# EAGLE design village_control (EAGLE 9.6.2)

## Sheet 1 of 3
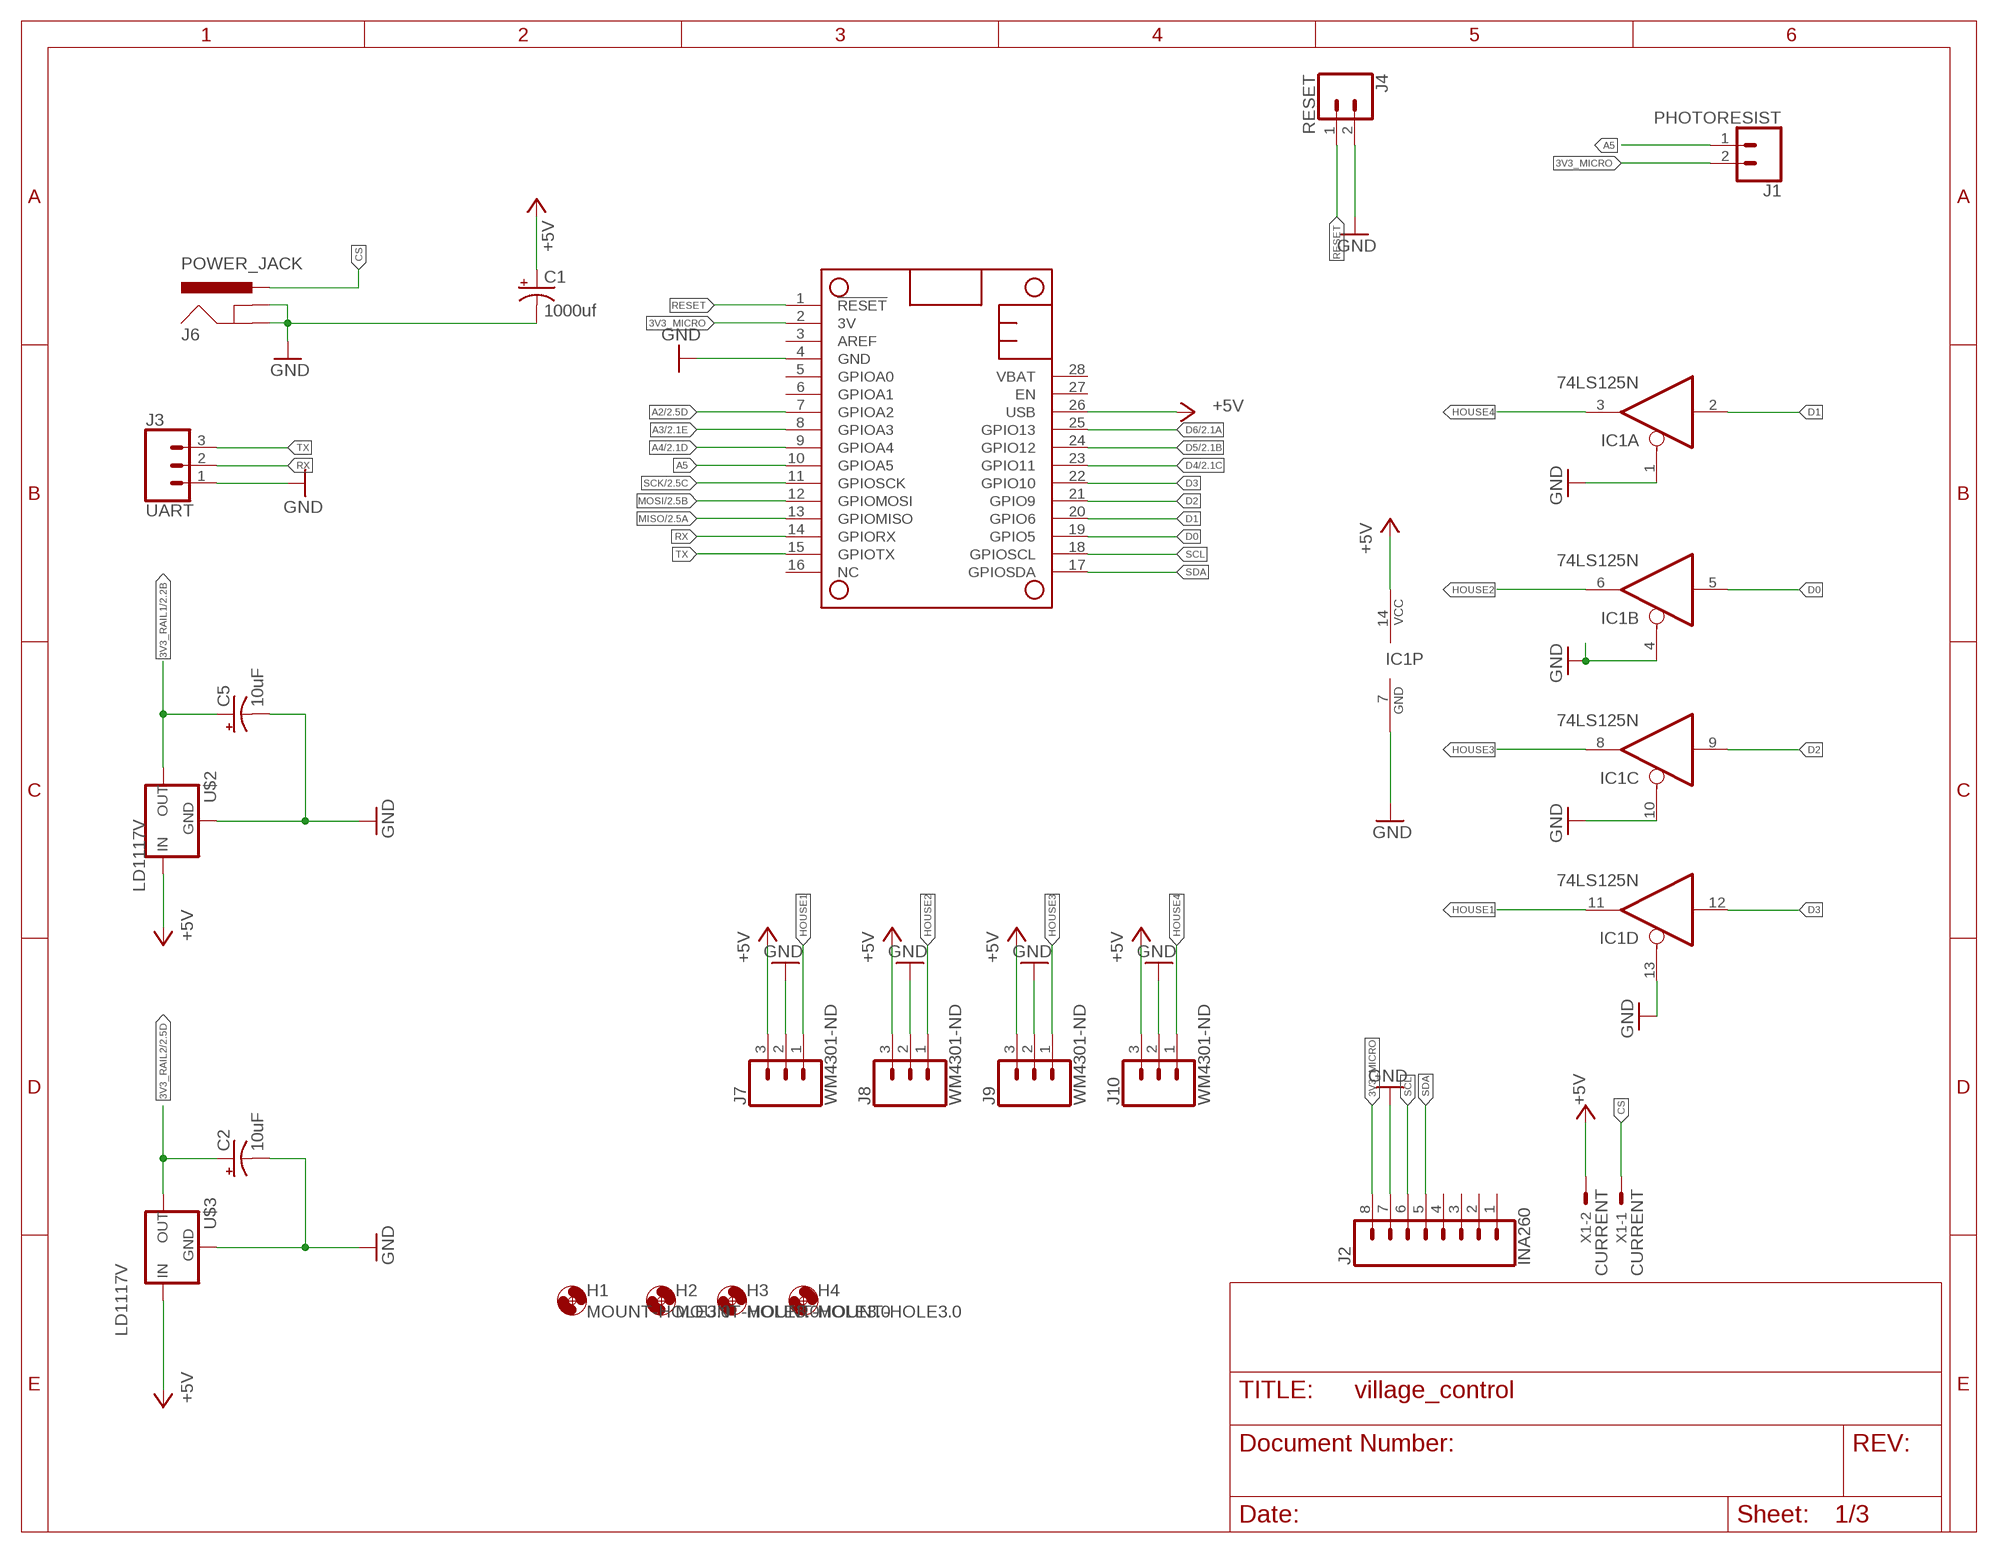
[diagram p0: schematic, sheet 1]

### Parts
C1  1000uf  1000UF-RADIAL-5MM-25V-20%  [CPOL-RADIAL-5MM-10MM]
C2  10uF  10UF-POLAR-RADIAL-2.5MM-KIT-25V-20%  [CPOL-RADIAL-2.5MM-5MM-KIT]
C5  10uF  10UF-POLAR-RADIAL-2.5MM-KIT-25V-20%  [CPOL-RADIAL-2.5MM-5MM-KIT]
H1  MOUNT-HOLE3.0  [3,0]
H2  MOUNT-HOLE3.0  [3,0]
H3  MOUNT-HOLE3.0  [3,0]
H4  MOUNT-HOLE3.0  [3,0]
IC1  74LS125N  [DIL14]
J1  PHOTORESIST  CONN_02  [1X02]
J2  INA260  CONN_08"  [1X08]
J3  UART  CONN_03  [1X03]
J4  RESET  CONN_02  [1X02]
J6  POWER_JACK  [POWER_JACK_PTH]
J7  WM4301-ND  CONN_03  [1X03]
J8  WM4301-ND  CONN_03  [1X03]
J9  WM4301-ND  CONN_03  [1X03]
J10  WM4301-ND  CONN_03  [1X03]
MS2  FEATHERWING_NODIM  [FEATHERWING_DIM]
U$2  LD1117V  V_REG_LD1117VXX  [78XXL]
U$3  LD1117V  V_REG_LD1117VXX  [78XXL]
X1  CURRENT  KK-156-2  [KK-156-2]

### Nets
3V3_MICRO: J1.2 J2.8 MS2.2(3V)
3V3_RAIL1: C5.1(+) U$2.GND(OUT) ; also sheet 2
3V3_RAIL2: C2.1(+) U$3.GND(OUT) ; also sheet 2
+5V: C1.+ IC1.14(P:VCC) J7.3 J8.3 J9.3 J10.3 MS2.26(USB) U$2.OUT(IN) U$3.OUT(IN) X1.2 ; also sheet 2
A2: MS2.7(GPIOA2) ; also sheet 2
A3: MS2.8(GPIOA3) ; also sheet 2
A4: MS2.9(GPIOA4) ; also sheet 2
A5: J1.1 MS2.10(GPIOA5)
CS: J6.PWR X1.1
D0: IC1.5(B:I) MS2.19(GPIO5)
D1: IC1.2(A:I) MS2.20(GPIO6)
D2: IC1.9(C:I) MS2.21(GPIO9)
D3: IC1.12(D:I) MS2.22(GPIO10)
D4: MS2.23(GPIO11) ; also sheet 2
D5: MS2.24(GPIO12) ; also sheet 2
D6: MS2.25(GPIO13) ; also sheet 2
GND: C1.- C2.2(-) C5.2(-) IC1.1(A:OE) IC1.4(B:OE) IC1.7(P:GND) IC1.10(C:OE) IC1.13(D:OE) J2.7 J3.1 J4.2 J6.GND J6.GNDBREAK J7.2 J8.2 J9.2 J10.2 MS2.4(GND) U$2.IN(GND) U$3.IN(GND) ; also sheet 2,3
HOUSE1: IC1.11(D:O) J7.1
HOUSE2: IC1.6(B:O) J8.1
HOUSE3: IC1.8(C:O) J9.1
HOUSE4: IC1.3(A:O) J10.1
MISO: MS2.13(GPIOMISO) ; also sheet 2
MOSI: MS2.12(GPIOMOSI) ; also sheet 2
RESET: J4.1 MS2.1(!RESET)
RX: J3.2 MS2.14(GPIORX)
SCK: MS2.11(GPIOSCK) ; also sheet 2
SCL: J2.6 MS2.18(GPIOSCL)
SDA: J2.5 MS2.17(GPIOSDA)
TX: J3.3 MS2.15(GPIOTX)
Unconnected: J2.1 J2.2 J2.3 J2.4 MS2.3(AREF) MS2.5(GPIOA0) MS2.6(GPIOA1) MS2.16(NC) MS2.27(EN) MS2.28(VBAT)

## Sheet 2 of 3
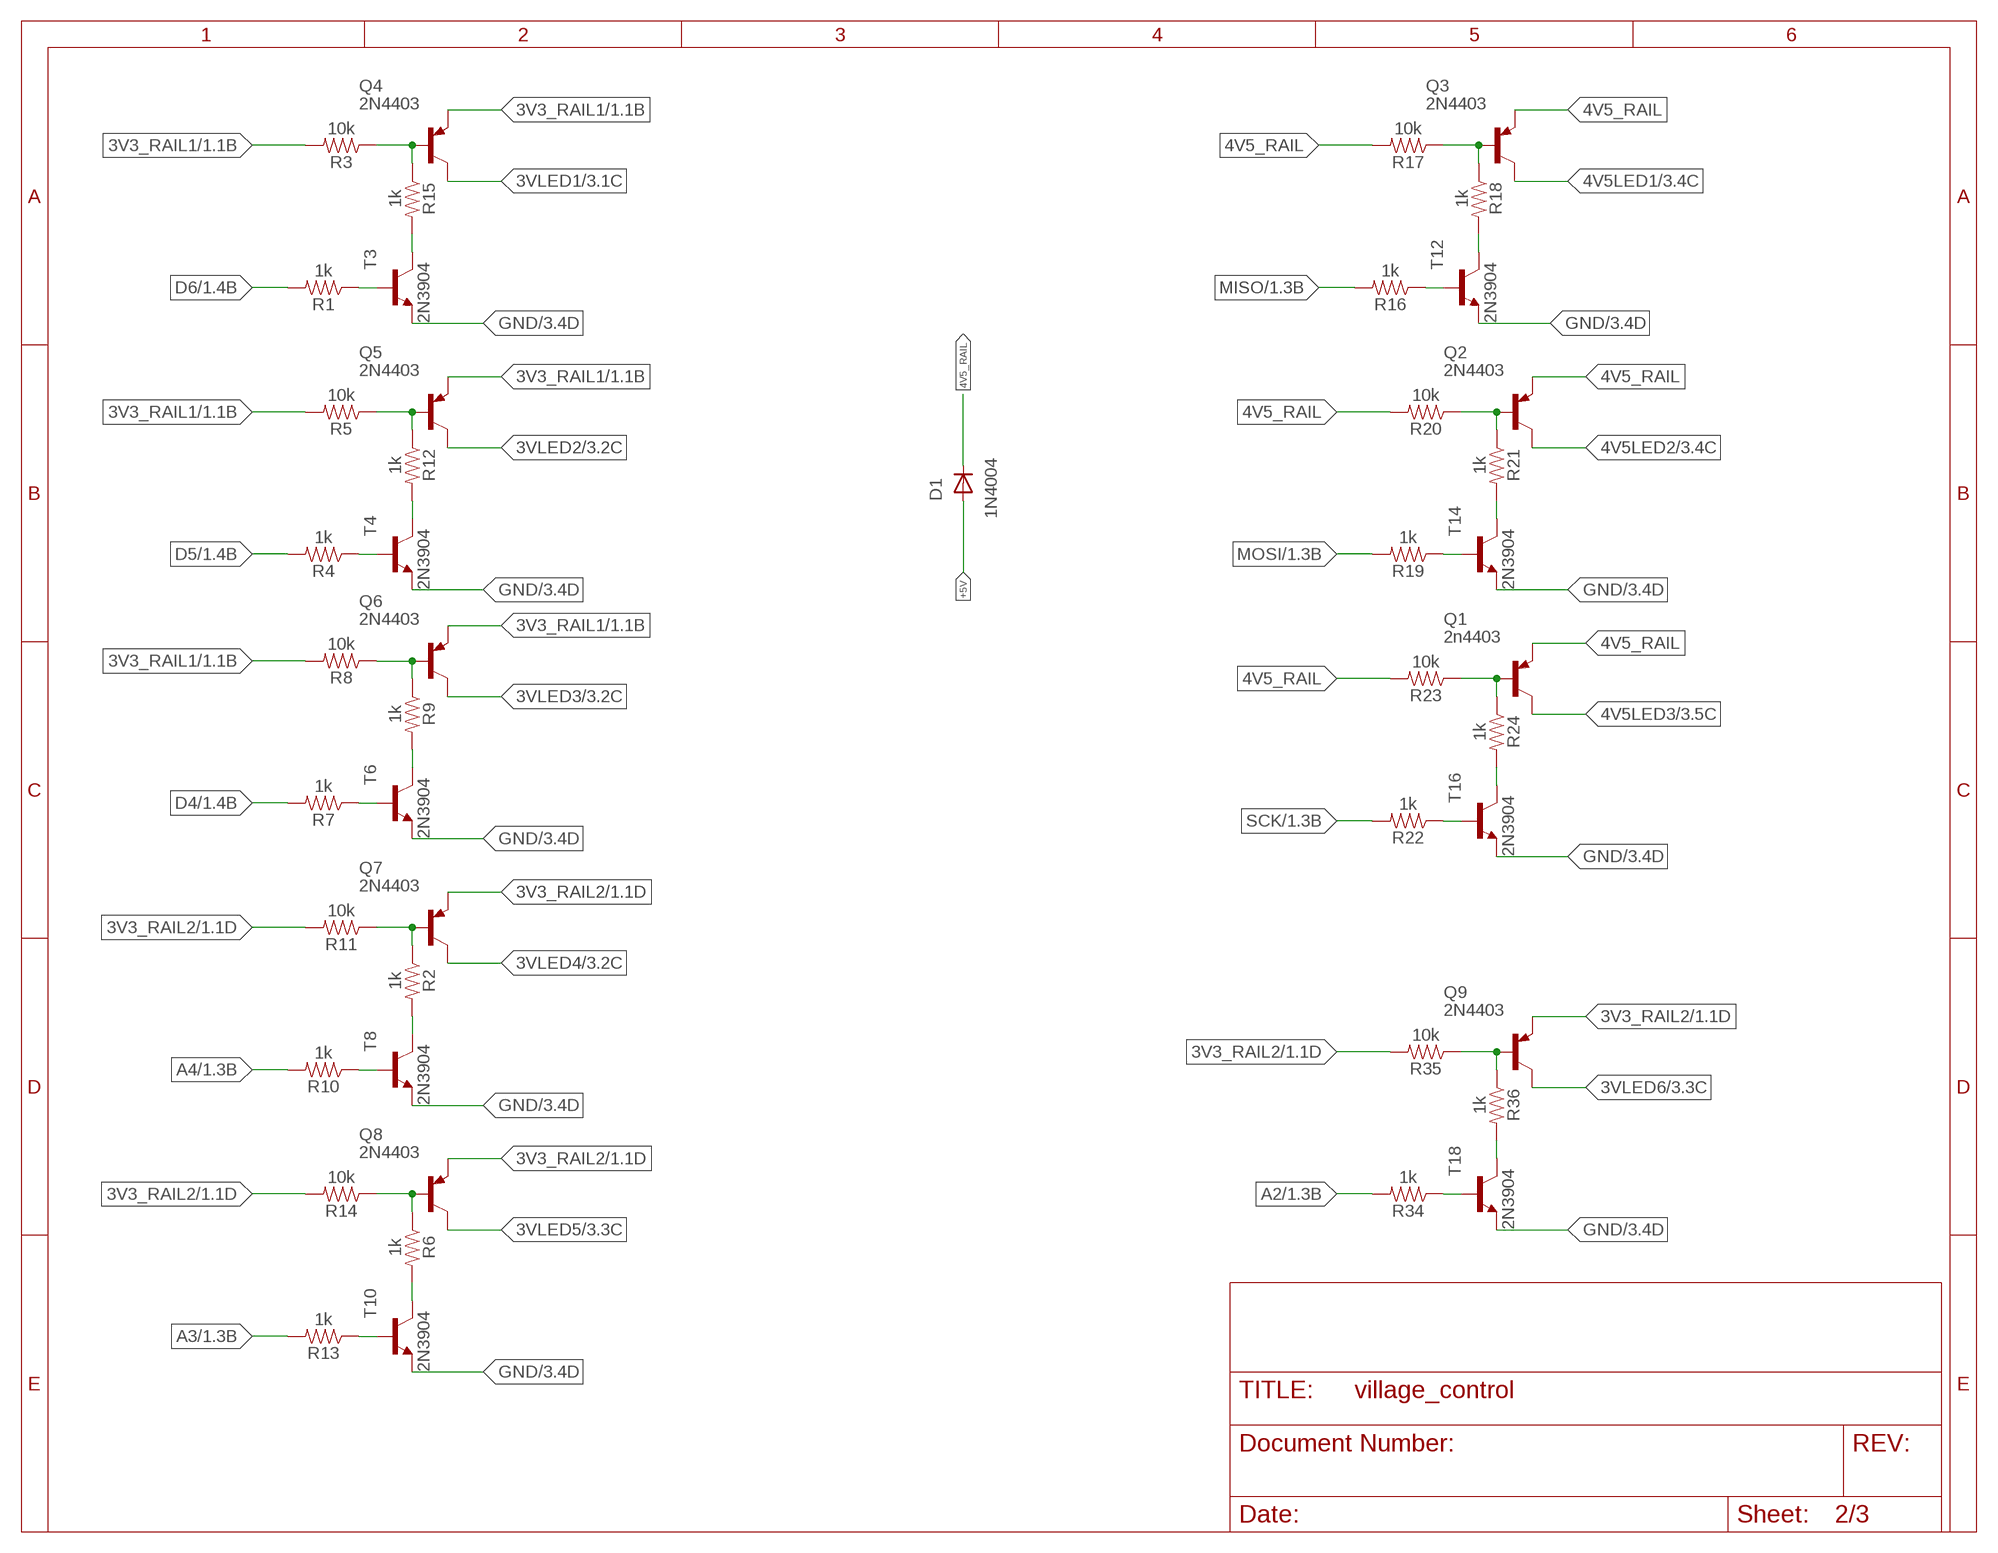
[diagram p1: schematic, sheet 2]

### Parts
D1  1N4004  [DO41-10]
Q1  2n4403  2N3906  [TO92]
Q2  2N4403  2N3906  [TO92]
Q3  2N4403  2N3906  [TO92]
Q4  2N4403  2N3906  [TO92]
Q5  2N4403  2N3906  [TO92]
Q6  2N4403  2N3906  [TO92]
Q7  2N4403  2N3906  [TO92]
Q8  2N4403  2N3906  [TO92]
Q9  2N4403  2N3906  [TO92]
R1  1k  1KOHM-HORIZ-1/4W-1%  [AXIAL-0.3]
R2  1k  1KOHM-HORIZ-1/4W-1%  [AXIAL-0.3]
R3  10k  1KOHM-HORIZ-1/4W-5%  [AXIAL-0.3]
R4  1k  1KOHM-HORIZ-1/4W-1%  [AXIAL-0.3]
R5  10k  1KOHM-HORIZ-1/4W-5%  [AXIAL-0.3]
R6  1k  1KOHM-HORIZ-1/4W-1%  [AXIAL-0.3]
R7  1k  1KOHM-HORIZ-1/4W-1%  [AXIAL-0.3]
R8  10k  1KOHM-HORIZ-1/4W-5%  [AXIAL-0.3]
R9  1k  1KOHM-HORIZ-1/4W-1%  [AXIAL-0.3]
R10  1k  1KOHM-HORIZ-1/4W-1%  [AXIAL-0.3]
R11  10k  1KOHM-HORIZ-1/4W-5%  [AXIAL-0.3]
R12  1k  1KOHM-HORIZ-1/4W-1%  [AXIAL-0.3]
R13  1k  1KOHM-HORIZ-1/4W-1%  [AXIAL-0.3]
R14  10k  1KOHM-HORIZ-1/4W-5%  [AXIAL-0.3]
R15  1k  1KOHM-HORIZ-1/4W-1%  [AXIAL-0.3]
R16  1k  1KOHM-HORIZ-1/4W-1%  [AXIAL-0.3]
R17  10k  1KOHM-HORIZ-1/4W-5%  [AXIAL-0.3]
R18  1k  1KOHM-HORIZ-1/4W-1%  [AXIAL-0.3]
R19  1k  1KOHM-HORIZ-1/4W-1%  [AXIAL-0.3]
R20  10k  1KOHM-HORIZ-1/4W-5%  [AXIAL-0.3]
R21  1k  1KOHM-HORIZ-1/4W-1%  [AXIAL-0.3]
R22  1k  1KOHM-HORIZ-1/4W-1%  [AXIAL-0.3]
R23  10k  1KOHM-HORIZ-1/4W-5%  [AXIAL-0.3]
R24  1k  1KOHM-HORIZ-1/4W-1%  [AXIAL-0.3]
R34  1k  1KOHM-HORIZ-1/4W-1%  [AXIAL-0.3]
R35  10k  1KOHM-HORIZ-1/4W-5%  [AXIAL-0.3]
R36  1k  1KOHM-HORIZ-1/4W-1%  [AXIAL-0.3]
T3  2N3904  [TO92]
T4  2N3904  [TO92]
T6  2N3904  [TO92]
T8  2N3904  [TO92]
T10  2N3904  [TO92]
T12  2N3904  [TO92]
T14  2N3904  [TO92]
T16  2N3904  [TO92]
T18  2N3904  [TO92]

### Nets
3V3_RAIL1: Q4.3(E) Q5.3(E) Q6.3(E) R3.P$2 R5.P$2 R8.P$2 ; also sheet 1
3V3_RAIL2: Q7.3(E) Q8.3(E) Q9.3(E) R11.P$2 R14.P$2 R35.P$2 ; also sheet 1
3VLED1: Q4.1(C) ; also sheet 3
3VLED2: Q5.1(C) ; also sheet 3
3VLED3: Q6.1(C) ; also sheet 3
3VLED4: Q7.1(C) ; also sheet 3
3VLED5: Q8.1(C) ; also sheet 3
3VLED6: Q9.1(C) ; also sheet 3
4V5_RAIL: D1.C Q1.3(E) Q2.3(E) Q3.3(E) R17.P$2 R20.P$2 R23.P$2
4V5LED1: Q3.1(C) ; also sheet 3
4V5LED2: Q2.1(C) ; also sheet 3
4V5LED3: Q1.1(C) ; also sheet 3
+5V: D1.A ; also sheet 1
A2: R34.P$2 ; also sheet 1
A3: R13.P$2 ; also sheet 1
A4: R10.P$2 ; also sheet 1
D4: R7.P$2 ; also sheet 1
D5: R4.P$2 ; also sheet 1
D6: R1.P$2 ; also sheet 1
GND: T3.3(E) T4.3(E) T6.3(E) T8.3(E) T10.3(E) T12.3(E) T14.3(E) T16.3(E) T18.3(E) ; also sheet 1,3
MISO: R16.P$2 ; also sheet 1
MOSI: R19.P$2 ; also sheet 1
N$1: Q4.2(B) R3.P$1 R15.P$1
N$2: R9.P$2 T6.1(C)
N$3: R4.P$1 T4.2(B)
N$4: R2.P$2 T8.1(C)
N$5: R7.P$1 T6.2(B)
N$6: R6.P$2 T10.1(C)
N$7: Q6.2(B) R8.P$1 R9.P$1
N$8: R12.P$2 T4.1(C)
N$9: R10.P$1 T8.2(B)
N$10: R1.P$1 T3.2(B)
N$11: Q7.2(B) R2.P$1 R11.P$1
N$12: R15.P$2 T3.1(C)
N$13: R13.P$1 T10.2(B)
N$14: Q8.2(B) R6.P$1 R14.P$1
N$15: R36.P$2 T18.1(C)
N$16: R16.P$1 T12.2(B)
N$17: Q5.2(B) R5.P$1 R12.P$1
N$18: Q3.2(B) R17.P$1 R18.P$1
N$19: R24.P$2 T16.1(C)
N$20: R19.P$1 T14.2(B)
N$21: Q2.2(B) R20.P$1 R21.P$1
N$22: R21.P$2 T14.1(C)
N$23: R22.P$1 T16.2(B)
N$24: Q1.2(B) R23.P$1 R24.P$1
N$32: R18.P$2 T12.1(C)
N$44: R34.P$1 T18.2(B)
N$45: Q9.2(B) R35.P$1 R36.P$1
SCK: R22.P$2 ; also sheet 1

## Sheet 3 of 3
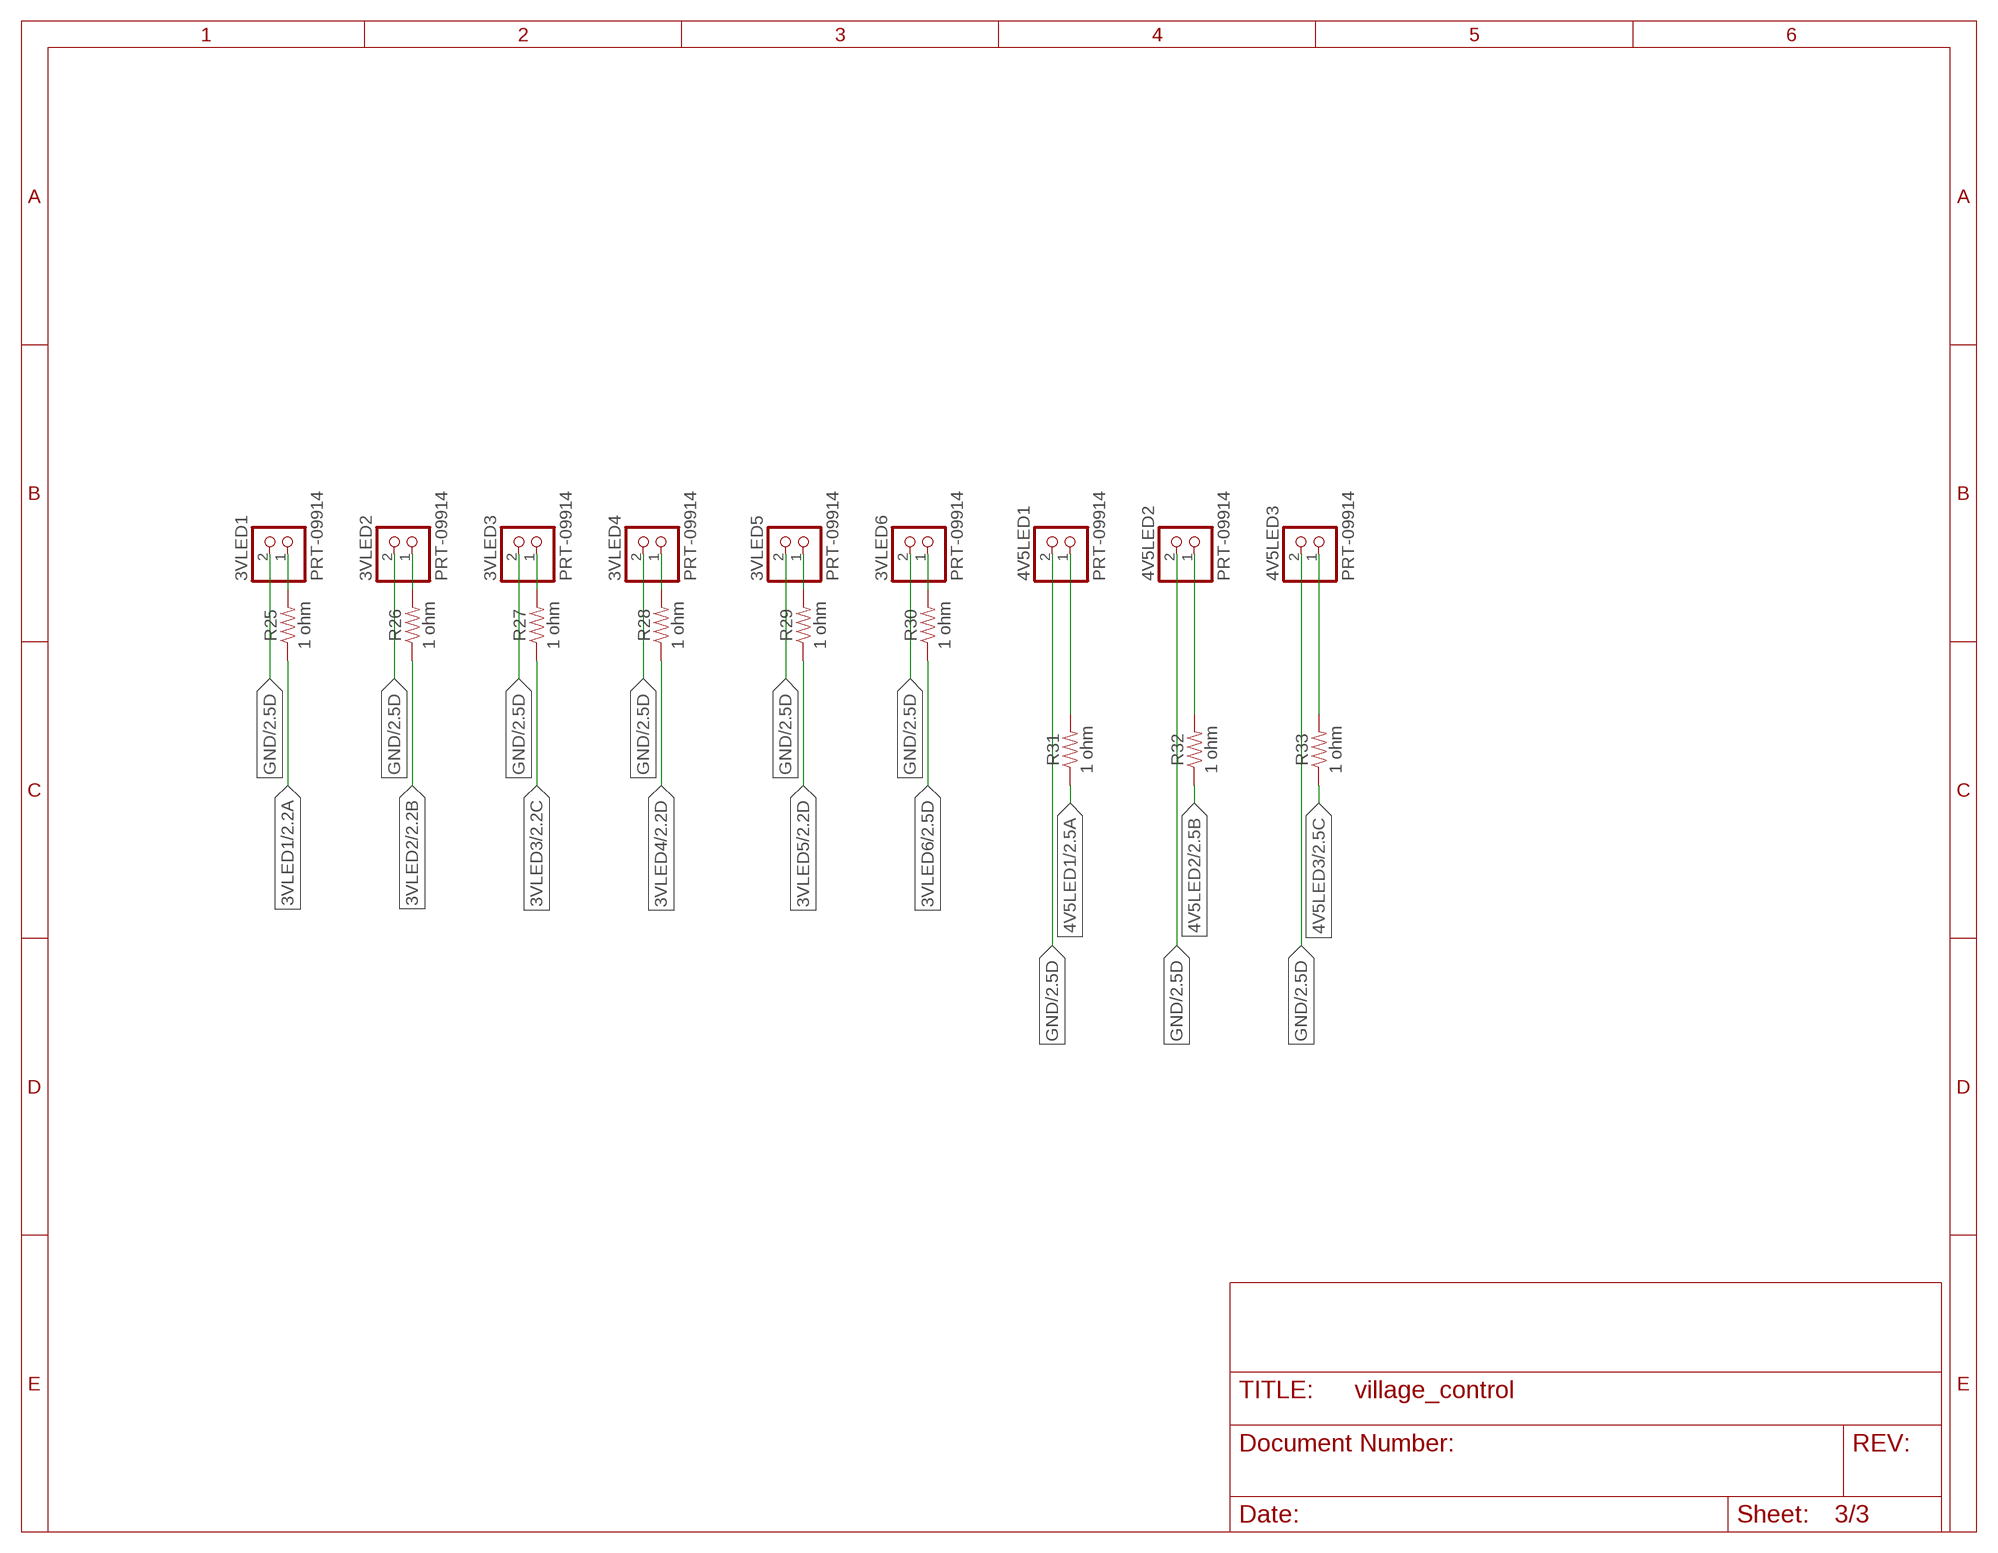
[diagram p2: schematic, sheet 3]

### Parts
3VLED1  PRT-09914  JST_2PIN-THM  [JST-PH-2-THM]
3VLED2  PRT-09914  JST_2PIN-THM  [JST-PH-2-THM]
3VLED3  PRT-09914  JST_2PIN-THM  [JST-PH-2-THM]
3VLED4  PRT-09914  JST_2PIN-THM  [JST-PH-2-THM]
3VLED5  PRT-09914  JST_2PIN-THM  [JST-PH-2-THM]
3VLED6  PRT-09914  JST_2PIN-THM  [JST-PH-2-THM]
4V5LED1  PRT-09914  JST_2PIN-THM  [JST-PH-2-THM]
4V5LED2  PRT-09914  JST_2PIN-THM  [JST-PH-2-THM]
4V5LED3  PRT-09914  JST_2PIN-THM  [JST-PH-2-THM]
R25  1 ohm  1KOHM-HORIZ-1/4W-5%  [AXIAL-0.3]
R26  1 ohm  1KOHM-HORIZ-1/4W-5%  [AXIAL-0.3]
R27  1 ohm  1KOHM-HORIZ-1/4W-5%  [AXIAL-0.3]
R28  1 ohm  1KOHM-HORIZ-1/4W-5%  [AXIAL-0.3]
R29  1 ohm  1KOHM-HORIZ-1/4W-5%  [AXIAL-0.3]
R30  1 ohm  1KOHM-HORIZ-1/4W-5%  [AXIAL-0.3]
R31  1 ohm  1KOHM-HORIZ-1/4W-5%  [AXIAL-0.3]
R32  1 ohm  1KOHM-HORIZ-1/4W-5%  [AXIAL-0.3]
R33  1 ohm  1KOHM-HORIZ-1/4W-5%  [AXIAL-0.3]

### Nets
3VLED1: R25.P$1 ; also sheet 2
3VLED2: R26.P$1 ; also sheet 2
3VLED3: R27.P$1 ; also sheet 2
3VLED4: R28.P$1 ; also sheet 2
3VLED5: R29.P$1 ; also sheet 2
3VLED6: R30.P$1 ; also sheet 2
4V5LED1: R31.P$1 ; also sheet 2
4V5LED2: R32.P$1 ; also sheet 2
4V5LED3: R33.P$1 ; also sheet 2
GND: 3VLED1.2 3VLED2.2 3VLED3.2 3VLED4.2 3VLED5.2 3VLED6.2 4V5LED1.2 4V5LED2.2 4V5LED3.2 ; also sheet 1,2
N$25: 3VLED1.1 R25.P$2
N$26: 4V5LED1.1 R31.P$2
N$27: 3VLED2.1 R26.P$2
N$28: 4V5LED2.1 R32.P$2
N$29: 3VLED3.1 R27.P$2
N$30: 4V5LED3.1 R33.P$2
N$31: 3VLED4.1 R28.P$2
N$33: 3VLED5.1 R29.P$2
N$35: 3VLED6.1 R30.P$2

## Library data of the parts
3VLED1-3VLED6 4V5LED1-4V5LED3 = adafruit:JST_2PIN: JST 2-Pin Connectors of various flavors SMT-RA (S2B-PH-SM4) 4UConnector #17311 SMT (B2B-PH-SM4) THM-RA (S2B-PH) THM (B2B-PH)
C1 = SparkFun-Capacitors:1000UF: 1,000µF/1mF ceramic capacitors A capacitor is a passive two-terminal electrical component used to store electrical energy temporarily in an electric field. CAP-08070; PROD_ID: CAP-09538; VALUE: 1mF
C2 C5 = SparkFun-Capacitors:10UF-POLAR: 10.0µF polarized capacitors A capacitor is a passive two-terminal electrical component used to store electrical energy temporarily in an electric field.; PROD_ID: CAP-08440
D1 = adafruit:1N4004: DIODE General purpose 1N400x type rectifier (With bigger pads) http://www.ladyada.net/library/pcb/eaglelibrary.html
H1-H4 = holes:MOUNT-HOLE: MOUNTING HOLE with drill center marker
IC1 = adafruit:74*125: Quad bus BUFFER, 3-state
J1 J4 = SparkFun-Connectors:CONN_02: Multi connection point. Often used as Generic Header-pin footprint for 0.1 inch spaced/style header connections On any of the 0.1 inch spaced packages, you can populate with these: Break Away Headers - Straight <https://www.sparkfun.com/products/116> (PRT-00116) Break Away Male Headers - Right Angle <https://www.sparkfun.com/products/553> (PRT-00553) Female Headers <https://www.sparkfun.com/products/115> (PRT-00115) Break Away Headers - Machine Pin <https://www.sparkfun.com/products/117> (PRT-00117) Break Away Female Headers - Swiss Machine Pin <https://www.sparkfun.com/products/743> (PRT-00743) For SCREWTERMINALS and SPRING TERMINALS visit here: Screw Terimnals on SparkFun.com <https://www.sparkfun.com/search/results?term=Screw+Terminals> (5mm/3.5mm/2.54mm spacing) This device is also useful as a general connection point to wire up your design to another part of your project. Our various solder wires solder well into these plated through hole pads. Hook-Up Wire - Assortment (Stranded, 22 AWG) <https://www.sparkfun.com/products/11375> (PRT-11375) Hook-Up Wire - Assortment (Solid Core, 22 AWG) <https://www.sparkfun.com/products/11367> (PRT-11367) View the entire wire category on our website here <https://www.sparkfun.com/categories/141> Special notes: Molex polarized connector foot print use with: PRT-08233 with associated crimp pins and housings. 2.54_SCREWTERM for use with PRT-10571. 3.5mm Screw Terminal footprints for PRT-08084 5mm Screw Terminal footprints for use with PRT-08432
J2 = SparkFun-Connectors:CONN_08: Multi connection point. Often used as Generic Header-pin footprint for 0.1 inch spaced/style header connections On any of the 0.1 inch spaced packages, you can populate with these: Break Away Headers - Straight <https://www.sparkfun.com/products/116> (PRT-00116) Break Away Male Headers - Right Angle <https://www.sparkfun.com/products/553> (PRT-00553) Female Headers <https://www.sparkfun.com/products/115> (PRT-00115) Break Away Headers - Machine Pin <https://www.sparkfun.com/products/117> (PRT-00117) Break Away Female Headers - Swiss Machine Pin <https://www.sparkfun.com/products/743> (PRT-00743) Arduino Stackable Header - 8 Pin <https://www.sparkfun.com/products/9279> (PRT-09279) For SCREWTERMINALS and SPRING TERMINALS visit here: Screw Terimnals on SparkFun.com <https://www.sparkfun.com/search/results?term=Screw+Terminals> (5mm/3.5mm/2.54mm spacing) This device is also useful as a general connection point to wire up your design to another part of your project. Our various solder wires solder well into these plated through hole pads. Hook-Up Wire - Assortment (Stranded, 22 AWG) <https://www.sparkfun.com/products/11375> (PRT-11375) Hook-Up Wire - Assortment (Solid Core, 22 AWG) <https://www.sparkfun.com/products/11367> (PRT-11367) View the entire wire category on our website here <https://www.sparkfun.com/categories/141> Special notes: Molex polarized connector foot print use with SKU : PRT-08231 with associated crimp pins and housings. 1MM SMD Version SKU: PRT-10208 NOTES ON THE VARIANTS LOCK and LOCK_LONGPADS... This footprint was designed to help hold the alignment of a through-hole component (i.e. 6-pin header) while soldering it into place. You may notice that each hole has been shifted either up or down by 0.005 of an inch from it's more standard position (which is a perfectly straight line). This slight alteration caused the pins (the squares in the middle) to touch the edges of the holes. Because they are alternating, it causes a "brace" to hold the component in place. 0.005 has proven to be the perfect amount of "off-center" position when using our standard breakaway headers. Although looks a little odd when you look at the bare footprint, once you have a header in there, the alteration is very hard to notice. Also,if you push a header all the way into place, it is covered up entirely on the bottom side.; PROD_ID: CONN-08438
J3 J7-J10 = SparkFun-Connectors:CONN_03: Multi connection point. Often used as Generic Header-pin footprint for 0.1 inch spaced/style header connections On any of the 0.1 inch spaced packages, you can populate with these: Break Away Headers - Straight <https://www.sparkfun.com/products/116> (PRT-00116) Break Away Male Headers - Right Angle <https://www.sparkfun.com/products/553> (PRT-00553) Female Headers <https://www.sparkfun.com/products/115> (PRT-00115) Break Away Headers - Machine Pin <https://www.sparkfun.com/products/117> (PRT-00117) Break Away Female Headers - Swiss Machine Pin <https://www.sparkfun.com/products/743> (PRT-00743) Stackable Header - 3 Pin (Female, 0.1") <https://www.sparkfun.com/products/13875> (PRT-13875) For SCREWTERMINALS and SPRING TERMINALS visit here: Screw Terimnals on SparkFun.com <https://www.sparkfun.com/search/results?term=Screw+Terminals> (5mm/3.5mm/2.54mm spacing) This device is also useful as a general connection point to wire up your design to another part of your project. Our various solder wires solder well into these plated through hole pads. Hook-Up Wire - Assortment (Stranded, 22 AWG) <https://www.sparkfun.com/products/11375> (PRT-11375) Hook-Up Wire - Assortment (Solid Core, 22 AWG) <https://www.sparkfun.com/products/11367> (PRT-11367) View the entire wire category on our website here <https://www.sparkfun.com/categories/141> Special notes: Molex polarized connector foot print use with SKU : PRT-08232 with associated crimp pins and housings.
J6 = SparkFun-Connectors:POWER_JACK: Power Jack Connector This is the standard 5.5mm barrel jack for power. The PTH is the most common, proven, reliable, footprint. The Slot footprint only works if the mill layer is transmitted to the PCB fab house so be warned. Here are the connectors we sell at SparkFun: DC Barrel Power Jack/Connector <https://www.sparkfun.com/products/119> (PRT-00119) DC Barrel Power Jack/Connector (SMD) <https://www.sparkfun.com/products/12748> (PRT-12748) DC Barrel Jack Adapter - Breadboard Compatible <https://www.sparkfun.com/products/10811> (PRT-10811) It is used on this SparkFun product (and many, many others): SparkFun RedBoard - Programmed with Arduino <https://www.sparkfun.com/products/12757> (DEV-12757) Also, if you need a mating power supply or connector, please check these out: Wall Adapter Power Supply - 9VDC 650mA <https://www.sparkfun.com/products/298> (TOL-00298) DC Barrel Jack Adapter - Male <https://www.sparkfun.com/products/10287> (PRT-10287); PROD_ID: CONN-08197
MS2 = adafruit:FEATHERWING
Q1-Q9 = transistor-pnp:2N3906: PNP Transistor
R1 R2 R4 R6 R7 R9 R10 R12 R13 R15 R16 R18 R19 R21 R22 R24 R34 R36 = SparkFun-Resistors:1KOHM: 1kΩ resistor A resistor is a passive two-terminal electrical component that implements electrical resistance as a circuit element. Resistors act to reduce current flow, and, at the same time, act to lower voltage levels within circuits. - Wikipedia; PROD_ID: RES-12182
R3 R5 R8 R11 R14 R17 R20 R23 R25-R33 R35 = SparkFun-Resistors:1KOHM: 1kΩ resistor A resistor is a passive two-terminal electrical component that implements electrical resistance as a circuit element. Resistors act to reduce current flow, and, at the same time, act to lower voltage levels within circuits. - Wikipedia; PROD_ID: RES-08380; VALUE: 1k
T3 T4 T6 T8 T10 T12 T14 T16 T18 = transistor:2N3904: NPN TRANSISTOR
U$2 U$3 = SparkFun-IC-Power:V_REG_LD1117VXX: LD1117VXX voltage regulator. We carry the 3.3V version (COM-00526) in TO-220 package.
X1 = con-molex:KK-156-2: KK 156 HEADER Source: http://www.molex.com/pdm_docs/sd/026604100_sd.pdf; MF: MOLEX; OC_FARNELL: unknown; OC_NEWARK: unknown

## Board
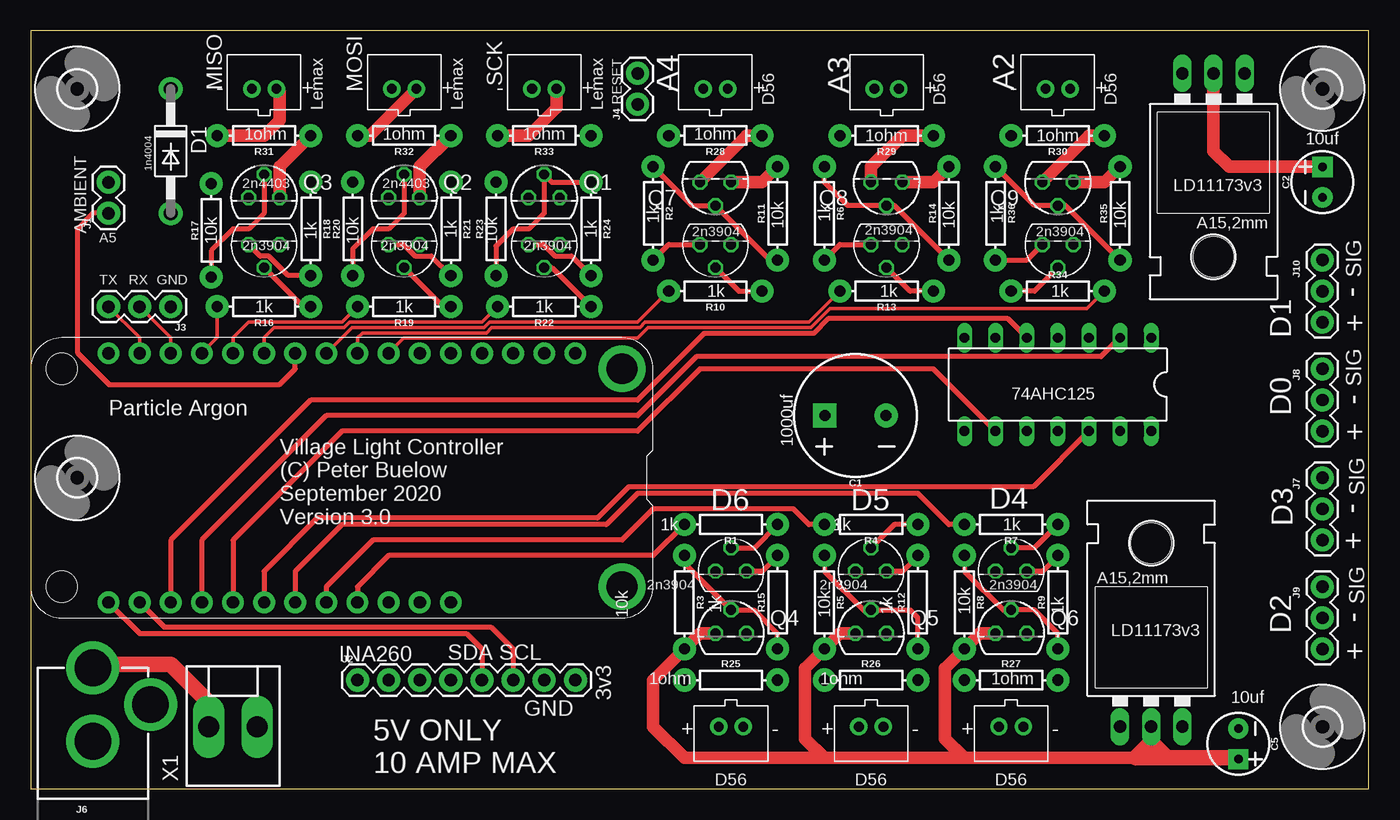
[diagram p3: board, top side]
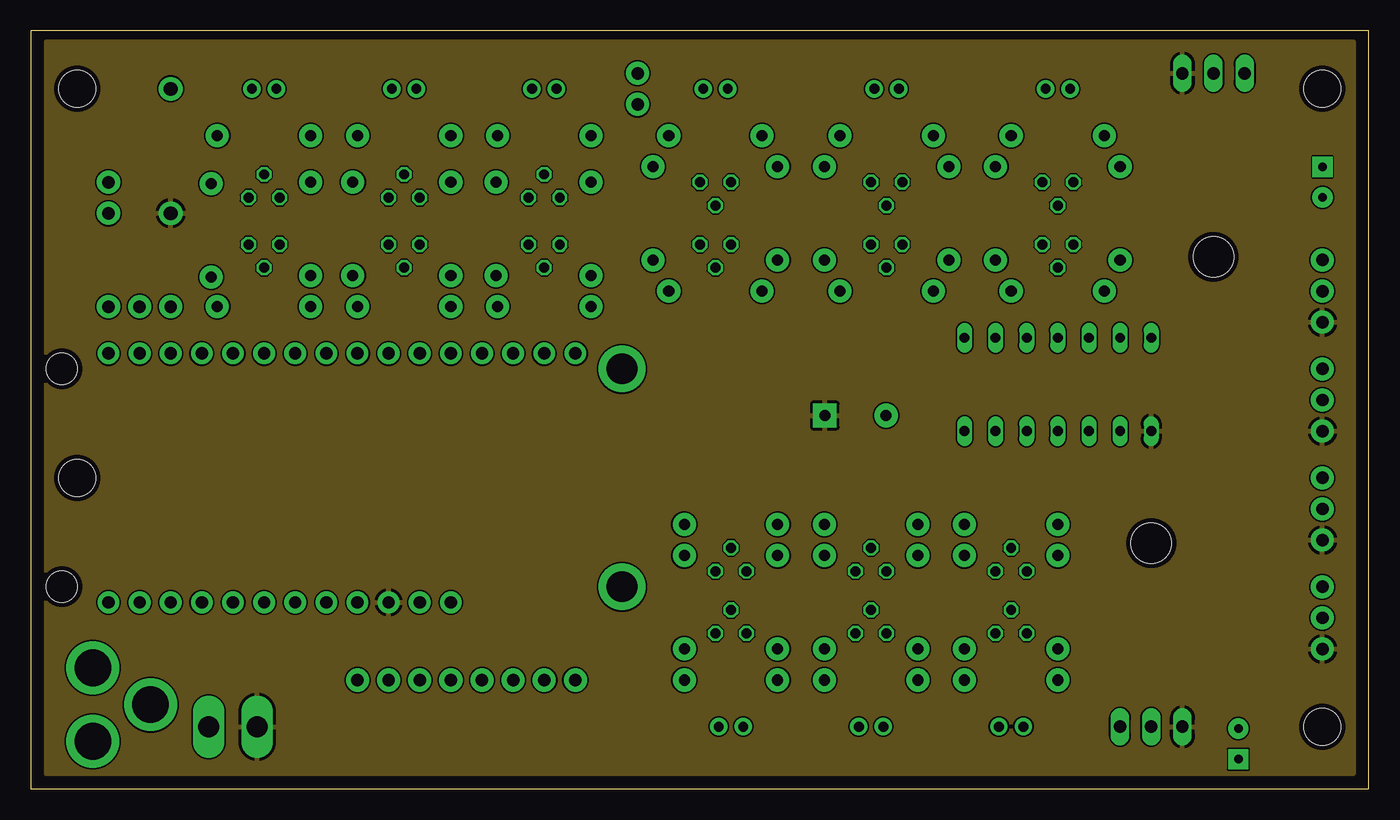
[diagram p4: board, inner layer Route2]
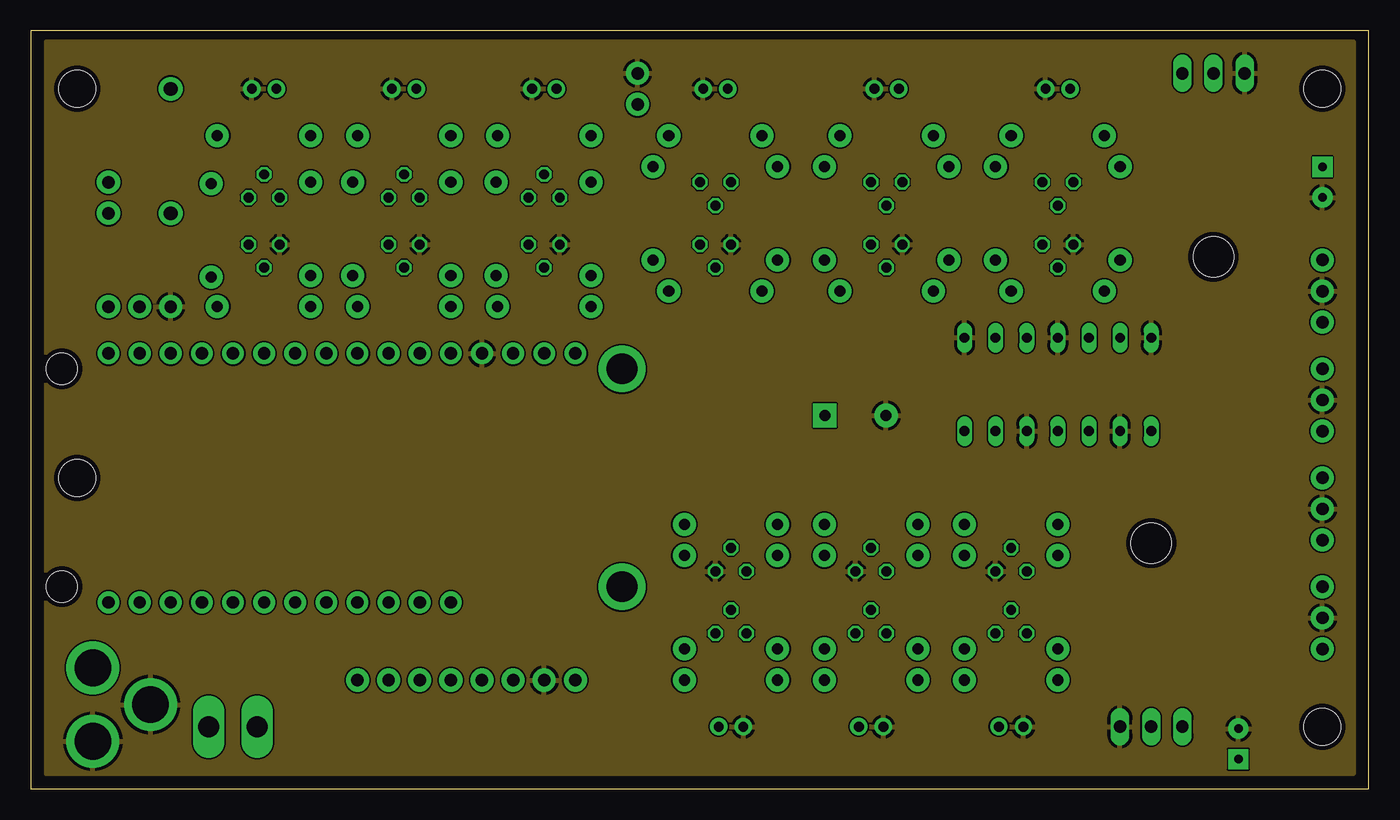
[diagram p5: board, inner layer Route15]
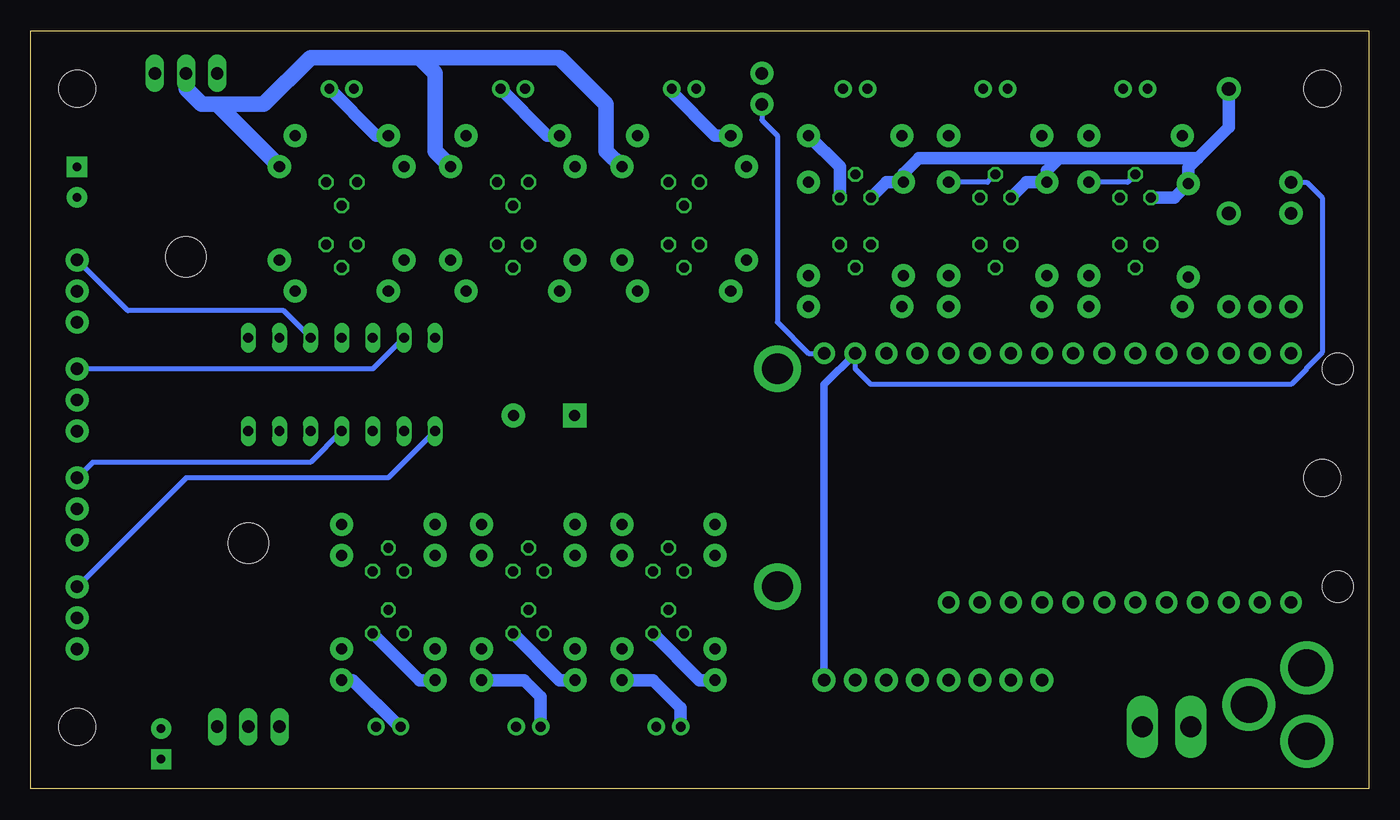
[diagram p6: board, bottom side, seen from below]

Size 109.2 x 61.9 mm. Coordinates in mm from the lower left corner, seen from the top.
Outline: 0,0 109.2,0 109.2,61.9 0,61.9 0,0
Copper layers (1*2*15*16): Top 0.035559375mm / dielectric 0.17018125mm / Route2 0.01778125mm / dielectric 47mil / Route15 0.01778125mm / dielectric 0.17018125mm / Bottom 0.035559375mm
Design rules "oshpark-4layer": minimum track width 5mil, minimum drill 10mil, track to track 5mil, track to pad 5mil, pad to pad 5mil, via to via 5mil, smd to smd 5mil, copper to edge 15mil, drill to drill 6mil, minimum pad ring 4mil, minimum via ring 4mil, stop-mask expansion 2.5mil, vias tented up to drill 0mil, thermal gap 10mil

### Footprints (pad centres in the part's own frame; a part is rotated, then mirrored left to right if it is on the bottom)
JST-PH-2-THM = drill 0.8 pad 1.422: 1 1,0; 2 -1,0
CPOL-RADIAL-5MM-10MM = drill 0.9 pad 1.93 square: + 2.5,0 | drill 0.9 pad 1.93: - -2.5,0
CPOL-RADIAL-2.5MM-5MM-KIT = drill 0.7 pad 1.651 square: 1 1.25,0 | drill 0.7 pad 1.651: 2 -1.25,0
DO41-10 = drill 1.118 pad 1.93: A 5.08,0; C -5.08,0
3,0 = hole 3: 0,0
DIL14 = drill 0.813 long: 1 -7.62,-3.81; 2 -5.08,-3.81; 3 -2.54,-3.81; 4 0,-3.81; 5 2.54,-3.81; 6 5.08,-3.81; 7 7.62,-3.81; 8 7.62,3.81; 9 5.08,3.81; 10 2.54,3.81; 11 0,3.81; 12 -2.54,3.81; 13 -5.08,3.81; 14 -7.62,3.81
1X02 = drill 1.016 pad 1.88: 1 0,0; 2 2.54,0
1X08 = drill 1.016 pad 1.88: 1 0,0; 2 2.54,0; 3 5.08,0; 4 7.62,0; 5 10.16,0; 6 12.7,0; 7 15.24,0; 8 17.78,0
1X03 = drill 1.016 pad 1.88: 1 0,0; 2 2.54,0; 3 5.08,0
POWER_JACK_PTH = drill 2.997 pad 4.318: GND 0,7.7; GNDBREAK 4.7,10.7; PWR 0,13.7
FEATHERWING_DIM = drill 1 pad 1.778: 1 6.35,1.27; 2 8.89,1.27; 3 11.43,1.27; 4 13.97,1.27; 5 16.51,1.27; 6 19.05,1.27; 7 21.59,1.27; 8 24.13,1.27; 9 26.67,1.27; 10 29.21,1.27; 11 31.75,1.27; 12 34.29,1.27; 13 36.83,1.27; 14 39.37,1.27; 15 41.91,1.27; 16 44.45,1.27; 17 44.45,21.59; 18 41.91,21.59; 19 39.37,21.59; 20 36.83,21.59; 21 34.29,21.59; 22 31.75,21.59; 23 29.21,21.59; 24 26.67,21.59; 25 24.13,21.59; 26 21.59,21.59; 27 19.05,21.59; 28 16.51,21.59 | drill 2.5 pad 3.81: P$1 2.54,20.32; P$2 2.54,2.54 | hole 2.54: 48.26,20.32; 48.26,2.54
TO92 = drill 0.813 octagon: 1 1.27,0; 2 0,1.905; 3 -1.27,0
AXIAL-0.3 = drill 0.9 pad 1.88: P$1 -3.81,0; P$2 3.81,0
78XXL = drill 1.016 long: GND 0,-3.81; IN -2.54,-3.81; OUT 2.54,-3.81 | hole 3.302: 0,11.176
KK-156-2 = drill 1.7 pad 2.184 long: 1 -1.98,0; 2 1.98,0

### Placement (x,y rotation side)
3VLED1  57.15,5.08 180 top
3VLED2  68.58,5.08 180 top
3VLED3  80.01,5.08 180 top
3VLED4  55.88,57.15 0 top
3VLED5  69.85,57.15 0 top
3VLED6  83.82,57.15 0 top
4V5LED1  19.05,57.15 0 top
4V5LED2  30.48,57.15 0 top
4V5LED3  41.91,57.15 0 top
C1  67.31,30.48 180 top
C2  105.41,49.53 90 top
C5  98.55,3.68 270 top
D1  11.43,52.07 270 top
H1  3.81,57.15 0 top
H2  105.41,57.15 0 top
H3  105.41,5.08 0 top
H4  3.81,25.4 0 top
IC1  83.82,33.02 180 top
J1  6.35,46.99 90 top
J2  26.67,8.89 0 top
J3  11.43,39.37 180 top
J4  49.53,55.88 90 top
J6  5.08,-3.81 0 top
J7  105.41,25.4 270 top
J8  105.41,34.29 270 top
J9  105.41,16.51 270 top
J10  105.41,43.18 270 top
MS2  50.8,36.83 180 top
Q1  41.91,48.26 0 top
Q2  30.48,48.26 0 top
Q3  19.05,48.26 0 top
Q4  57.15,12.7 0 top
Q5  68.58,12.7 0 top
Q6  80.01,12.7 0 top
Q7  55.88,49.53 180 top
Q8  69.85,49.53 180 top
Q9  83.82,49.53 180 top
R1  57.15,21.59 180 top
R2  50.8,46.99 270 top
R3  53.34,15.24 270 top
R4  68.58,21.59 180 top
R5  64.77,15.24 270 top
R6  64.77,46.99 270 top
R7  80.01,21.59 180 top
R8  76.2,15.24 270 top
R9  83.82,15.24 90 top
R10  55.88,40.64 180 top
R11  60.96,46.99 90 top
R12  72.39,15.24 90 top
R13  69.85,40.64 180 top
R14  74.93,46.99 90 top
R15  60.96,15.24 90 top
R16  19.05,39.37 180 top
R17  14.73,45.59 90 top
R18  22.86,45.72 270 top
R19  30.48,39.37 180 top
R20  26.29,45.72 90 top
R21  34.29,45.72 270 top
R22  41.91,39.37 180 top
R23  37.97,45.72 90 top
R24  45.72,45.72 270 top
R25  57.15,8.89 0 top
R26  68.58,8.89 0 top
R27  80.01,8.89 0 top
R28  55.88,53.34 180 top
R29  69.85,53.34 180 top
R30  83.82,53.34 180 top
R31  19.05,53.34 180 top
R32  30.48,53.34 180 top
R33  41.91,53.34 180 top
R34  83.82,40.64 0 top
R35  88.9,46.99 90 top
R36  78.74,46.99 270 top
T3  57.15,17.78 0 top
T4  68.58,17.78 0 top
T6  80.01,17.78 0 top
T8  55.88,44.45 180 top
T10  69.85,44.45 180 top
T12  19.05,44.45 180 top
T14  30.48,44.45 180 top
T16  41.91,44.45 180 top
T18  83.82,44.45 180 top
U$2  91.44,8.89 0 top
U$3  96.52,54.61 180 top
X1  16.51,5.08 0 top

### Tracks (layer width: path | path; a pad name or v marks a point on that pad's centre or on a via)
3V3_MICRO
  Bottom 0.406: J1.2 5.08,49.53 3.81,48.26 3.81,35.64 5.08,34.37 5.08,34.29 6.35,33.02 40.64,33.02 41.91,34.29 MS2.2
  Bottom 0.61: MS2.2 44.45,33.02 J2.8
3V3_RAIL1
  Top 1.016: U$2.GND 91.44,3.81 | Q5.3 66.04,12.7 R5.P$2 63.2,9.86 63.2,4.12 64.77,2.54 | Q6.3 77.47,12.7 R8.P$2 74.62,9.86 74.62,4.12 76.2,2.54 | Q4.3 54.61,12.7 R3.P$2 50.8,8.89 50.8,5.08 53.34,2.54 64.77,2.54 | 90.17,2.54 76.2,2.54 | 76.2,2.54 64.77,2.54
  Top 1.27: 92.71,2.54 91.44,3.81 90.17,2.54 92.71,2.54 | C5.1 98.44,2.54 92.71,2.54
3V3_RAIL2
  Top 1.016: U$3.GND 96.52,52.07 97.81,50.78 C2.1 | R35.P$2 87.63,49.53 Q9.3 | R14.P$2 73.66,49.53 Q8.3 | R11.P$2 59.69,49.53 Q7.3
  Bottom 1.27: U$3.GND 96.52,57.15 95.25,55.88 93.98,55.88 | 77.47,59.69 86.36,59.69 90.17,55.88 93.98,55.88 | 77.47,59.69 66.04,59.69 62.23,55.88 62.23,52.07 R11.P$2 | R14.P$2 76.2,52.07 76.2,58.42 77.47,59.69 | R35.P$2 93.98,55.88
3VLED1
  Bottom 1.016: Q4.1 54.61,8.89 R25.P$1
3VLED2
  Bottom 1.016: R26.P$1 66.04,8.89 Q5.1
3VLED3
  Bottom 1.016: Q6.1 77.47,8.89 R27.P$1
3VLED4
  Top 1.016: R28.P$1 58.42,53.34 Q7.1
3VLED5
  Top 1.016: R29.P$1 71.12,53.34 68.58,50.8 Q8.1
3VLED6
  Top 1.016: R30.P$1 86.36,53.34 Q9.1
4V5_RAIL
  Bottom 1.016: 25.27,51.49 13.97,51.49 | 13.97,51.49 11.43,54.03 D1.C | 25.27,51.49 36.7,51.49 37.97,50.22 R23.P$2 39.37,49.53 Q1.3 | 25.27,51.49 26.29,50.47 R20.P$2 27.94,49.53 Q2.3 | Q3.3 15.88,48.26 R17.P$2 14.73,50.72 13.97,51.49
4V5LED1
  Top 1.016: Q3.1 20.32,50.8 R31.P$1
4V5LED2
  Top 1.016: Q2.1 31.75,50.8 R32.P$1
4V5LED3
  Bottom 1.016: R33.P$1 43.18,50.8 Q1.1
+5V
  pour Route2: 1.27,60.96 1.27,1.27 107.95,1.27 107.95,60.96
A2
  Top 0.305: R34.P$2 86.21,39.22 65.23,39.22 63.68,37.67 50.37,37.67 49.5,36.8 30.45,36.8 MS2.7
A3
  Top 0.305: R13.P$2 63.5,38.1 50.14,38.1 49.71,37.67 38.1,37.67 37.67,37.67 37.62,37.67 37.19,37.24 27.08,37.24 26.67,36.83 MS2.8
A4
  Top 0.305: R10.P$2 49.53,38.1 38.1,38.1 37.44,38.1 37.01,37.67 26.24,37.67 MS2.9
A5
  Top 0.406: MS2.10 21.59,34.29 20.32,33.02 6.35,33.02 6.35,33.1 3.81,35.64 3.81,45.72 5.08,46.99 J1.1
CS
  Top 1.27: J6.PWR 5.35,10.16 11.43,10.16 14.61,6.99 14.61,5.16 X1.1
D0
  Top 0.406: IC1.5 79.73,38.38 65.07,38.38 63.88,37.19 54.97,37.19 49.53,31.75 22.86,31.75 11.43,20.32 MS2.19
D1
  Top 0.406: IC1.2 87.35,35.28 54.33,35.28 49.53,30.48 24.13,30.48 13.97,20.32 MS2.20
D2
  Top 0.406: IC1.9 73.66,34.29 54.61,34.29 49.53,29.21 25.4,29.21 16.51,20.32 MS2.21
D3
  Top 0.406: IC1.12 81.81,24.66 48.79,24.66 46.25,22.12 23.39,22.12 19.05,17.78 MS2.22
D4
  Top 0.406: R7.P$2 74.93,21.59 72.39,24.13 49.53,24.13 46.99,21.59 25.4,21.59 21.59,17.78 MS2.23
D5
  Top 0.406: R4.P$2 63.5,21.59 62.23,22.86 50.8,22.86 48.26,20.32 27.94,20.32 24.13,16.51 MS2.24
D6
  Top 0.406: R1.P$2 50.8,19.05 29.21,19.05 26.67,16.51 MS2.25
GND
  pour Route15: 1.27,60.96 1.27,1.27 107.95,1.27 107.95,60.96
HOUSE1
  Bottom 0.406: IC1.11 86.36,26.67 104.14,26.67 J7.1
HOUSE2
  Bottom 0.406: IC1.6 81.28,34.29 J8.1
HOUSE3
  Bottom 0.406: IC1.8 80.01,25.4 96.52,25.4 J9.1
HOUSE4
  Bottom 0.406: IC1.3 88.57,39.04 101.27,39.04 J10.1
MISO
  Top 0.305: R16.P$2 15.24,36.83 MS2.13
MOSI
  Top 0.305: MS2.12 16.51,36.83 17.78,38.1 25.4,38.1 R19.P$2
N$1
  Top 0.406: R3.P$1 53.34,18.41 Q4.2 59.05,14.61 60.96,12.7 R15.P$1
N$2
  Top 0.406: R9.P$2 82.55,17.78 T6.1
N$3
  Top 0.406: R4.P$1 70.48,21.59 T4.2
N$4
  Top 0.406: R2.P$2 52.07,44.45 T8.1
N$5
  Top 0.406: R7.P$1 81.91,19.68 T6.2
N$6
  Top 0.406: R6.P$2 66.04,44.45 T10.1
N$7
  Top 0.406: R8.P$1 76.2,17.78 79.38,14.61 Q6.2 81.91,14.61 83.82,12.7 R9.P$1
N$8
  Top 0.406: R12.P$2 71.12,17.78 T4.1
N$9
  Top 0.406: T8.2 57.78,40.64 R10.P$1
N$10
  Top 0.406: T3.2 59.05,19.68 R1.P$1
N$11
  Top 0.406: R2.P$1 53.98,47.62 Q7.2 60.32,43.18 R11.P$1
N$12
  Top 0.406: R15.P$2 59.69,17.78 T3.1
N$13
  Top 0.406: R13.P$1 71.75,40.64 T10.2
N$14
  Top 0.406: R14.P$1 70.48,47.62 Q8.2 66.67,47.62 64.77,49.53 R6.P$1
N$15
  Top 0.406: R36.P$2 81.28,43.18 T18.1
N$16
  Top 0.406: R16.P$1 22.23,39.37 T12.2
N$17
  Top 0.406: R12.P$1 72.39,13.97 71.75,14.61 Q5.2 67.95,14.61 64.77,17.78 R5.P$1
N$18
  Top 0.406: Q3.2 19.05,46.99 17.78,45.72 16.51,45.72 14.73,43.94 R17.P$1
  Bottom 0.406: Q3.2 19.69,49.53 R18.P$1
N$19
  Top 0.406: T16.1 41.85,44.45 42.79,43.51 44.12,43.51 R24.P$2
N$20
  Top 0.406: R19.P$1 33.66,39.37 T14.2
N$21
  Top 0.406: Q2.2 30.48,46.99 29.21,45.72 27.94,45.72 26.29,44.07 R20.P$1
  Bottom 0.406: Q2.2 31.12,49.53 R21.P$1
N$22
  Top 0.406: T14.1 30.42,44.45 31.36,43.51 32.69,43.51 R21.P$2
N$23
  Top 0.406: T16.2 42.55,42.55 R22.P$1
N$24
  Top 0.406: R24.P$1 42.55,49.53 Q1.2 41.91,46.99 40.64,45.72 39.37,45.72 37.97,44.32 R23.P$1
N$25
  Bottom 1.016: 3VLED1.1 56.15,6.62 58.42,8.89 R25.P$2
N$26
  Top 1.016: R31.P$2 19.05,53.34 20.32,54.61 20.32,56.88 4V5LED1.1
N$27
  Bottom 1.016: R26.P$2 68.95,8.89 67.58,7.52 3VLED2.1
N$28
  Top 1.016: 4V5LED2.1 27.67,53.34 R32.P$2
N$29
  Bottom 1.016: R27.P$2 82.92,8.89 79.11,5.08 3VLED3.1
N$30
  Top 1.016: 4V5LED3.1 42.91,55.61 40.64,53.34 R33.P$2
N$31
  Bottom 1.016: R28.P$2 53.34,53.34 56.88,56.88 3VLED4.1
N$32
  Top 0.406: T12.1 18.74,43.48 19.44,43.48 21.01,41.91 R18.P$2
N$33
  Bottom 1.016: 3VLED5.1 67.04,53.34 R29.P$2
N$35
  Bottom 1.016: 3VLED6.1 81.01,53.34 R30.P$2
N$44
  Top 0.406: T18.2 81.91,40.64 R34.P$1
N$45
  Top 0.406: R36.P$1 81.91,47.62 Q9.2 84.45,47.62 R35.P$1
RESET
  Bottom 0.406: J4.1 49.53,54.61 48.26,53.34 48.26,38.1 45.72,35.56 MS2.1
RX
  Top 0.305: J3.2 11.43,36.83 MS2.14
SCK
  Top 0.305: R22.P$2 36.83,38.1 26.01,38.1 25.58,37.67 19.89,37.67 19.05,36.83 MS2.11
SCL
  Top 0.406: MS2.18 10.9,13.23 37.57,13.23 39.37,11.43 J2.6
SDA
  Top 0.406: MS2.17 8.89,12.7 35.56,12.7 36.83,11.43 J2.5
TX
  Top 0.305: J3.3 8.89,36.83 MS2.15

### Text on the board
_tsilk: Lemax | Lemax | Lemax | A3 | D56 | D56 | D56 | MISO | MOSI | SCK | A4 | A2 | RESET | 1ohm | 1ohm | 1ohm | 1ohm | 1ohm | 1ohm | 10uf | 1n4004 | 2n4403 | 2n4403 | LD11173v3 | 1k | 1k | 1k | 10k | 10k | 10k | AMBIENT | A5 | 1k | 1k | 1k | 2n3904 | 2n3904 | 2n3904 | 10k | 2n3904 | 10k | 2n3904 | 10k | 2n3904 | SIG | TX | RX | GND | 1k | 1k | 1k | - | 1k | 1k | 1k | D1 | + | SIG | 74AHC125 | - | Particle Argon | D0 | 1000uf | + | D6 | D5 | D4 | SIG | Village Light Controller / (C) Peter Buelow / September 2020 / Version 3.0 | 1k | 1k | 1k | - | D3 | + | 2n3904 | 2n3904 | 2n3904 | SIG | 10k | 1k | 10k | 1k | 10k | 1k | - | D2 | LD11173v3 | SDA | SCL | INA260 | + | 1ohm | 1ohm | 1ohm | 3v3 | 10uf | GND | 5V ONLY / 10 AMP MAX | D56 | D56 | D56
_bsilk: Village Light Controller / Lemax, D56, WS2812 / Version 1.1 / (C) Peter Buelow / March 2020